# Altium project Hexapodik.PrjPcb
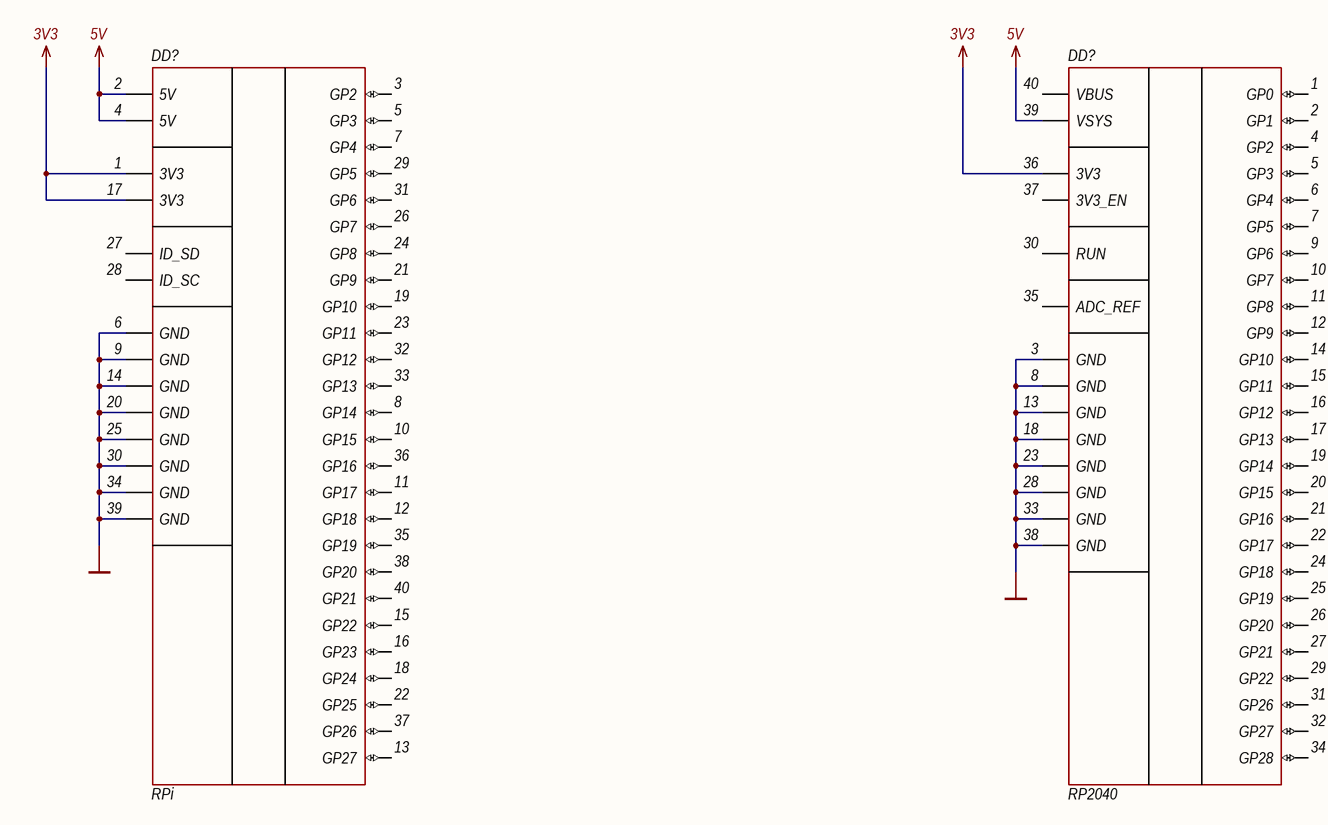
[diagram p0: Hexa.SchDoc]
1 sheet, 2 parts. Net scope: global (net labels, ports and power ports of the same name join across sheets).

## Sheet Hexa.SchDoc: Title
size 594 x 420 mm; CompanyName: Лаборатория беспилотных систем; Address1: Address1; Address2: Address2; Address3: Address3; Address4: Address4; DocumentNumber: АБВГ.123456.001 Э3; SheetNumber: 1; SheetTotal: 1; Scale: -; DocumentType: Схема электрическая принципиальная; FirstReferrence: АБВГ.123456.001

### Parts
(Parts that share a designator on the sheet are numbered #1, #2 ... from top to bottom, then left to right.)
DD?#1  RPi
DD?#2  RP2040

### Nets
3V3: DD?#1.1(3V3) DD?#1.17(3V3) DD?#2.36(3V3)
5V: DD?#1.2(5V) DD?#1.4(5V) DD?#2.39(VSYS)
GND: DD?#1.6(GND) DD?#1.9(GND) DD?#1.14(GND) DD?#1.20(GND) DD?#1.25(GND) DD?#1.30(GND) DD?#1.34(GND) DD?#1.39(GND) DD?#2.3(GND) DD?#2.8(GND) DD?#2.13(GND) DD?#2.18(GND) DD?#2.23(GND) DD?#2.28(GND) DD?#2.33(GND) DD?#2.38(GND)

Not connected (* = marked no-connect by the designer): DD?#1 3(GP2) 5(GP3) 7(GP4) 8(GP14) 10(GP15) 11(GP17) 12(GP18) 13(GP27) 15(GP22) 16(GP23) 18(GP24) 19(GP10) 21(GP9) 22(GP25) 23(GP11) 24(GP8) 26(GP7) 27(ID_SD) 28(ID_SC) 29(GP5) 31(GP6) 32(GP12) 33(GP13) 35(GP19) 36(GP16) 37(GP26) 38(GP20) 40(GP21); DD?#2 1(GP0) 2(GP1) 4(GP2) 5(GP3) 6(GP4) 7(GP5) 9(GP6) 10(GP7) 11(GP8) 12(GP9) 14(GP10) 15(GP11) 16(GP12) 17(GP13) 19(GP14) 20(GP15) 21(GP16) 22(GP17) 24(GP18) 25(GP19) 26(GP20) 27(GP21) 29(GP22) 30(RUN) 31(GP26) 32(GP27) 34(GP28) 35(ADC_REF) 37(3V3_EN) 40(VBUS)

### Notes on the sheet
- ЛБС